# EAGLE schematic attiny85 (EAGLE 9.6.2)
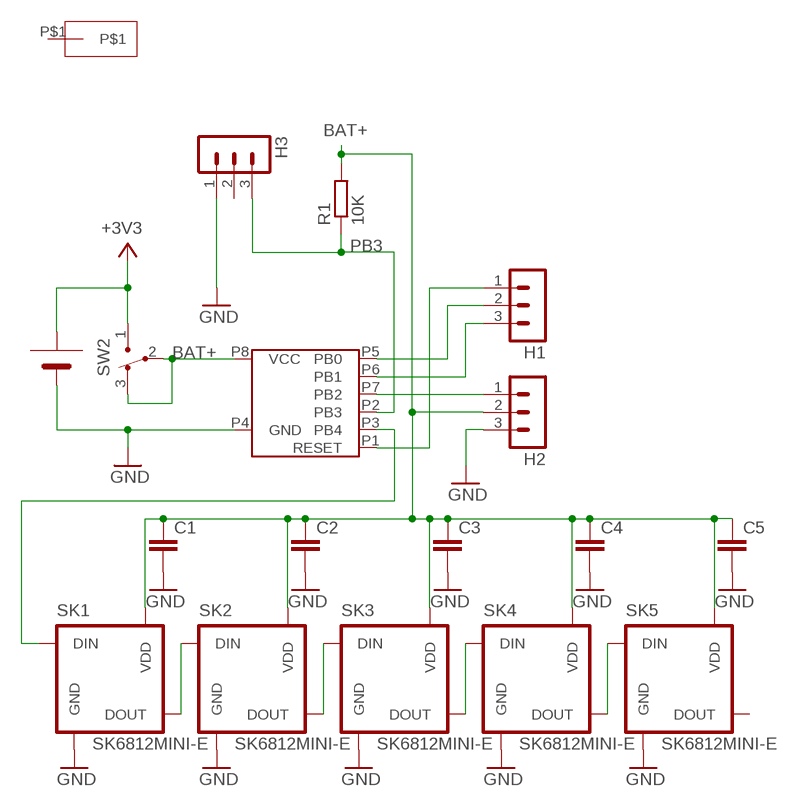
[diagram p0: schematic, sheet 1]

## Parts
ATTINY85-1  ATTINY85  ATTINY85SOP8  [ATTINY85-20SUR]
BAT1  BAT-CR2032B  [BAT-CR2032-2]
C1  C-EUC2012  [C2012]
C2  C-EUC2012  [C2012]
C3  C-EUC2012  [C2012]
C4  C-EUC2012  [C2012]
C5  C-EUC2012  [C2012]
H1  PINHEAD-MA03-1SMD  [PINHEAD-MA03-2]
H2  PINHEAD-MA03-1SMD  [PINHEAD-MA03-2]
H3  PINHEAD-MA03-1  [PINHEAD-MA03-1]
PAD33  PAD_10X3  [PAD-10X3]
R1  10K  R-EU_M3216  [M3216]
SK1  SK6812MINI-E  [SK6812MINI-E]
SK2  SK6812MINI-E  [SK6812MINI-E]
SK3  SK6812MINI-E  [SK6812MINI-E]
SK4  SK6812MINI-E  [SK6812MINI-E]
SK5  SK6812MINI-E  [SK6812MINI-E]
SW2  POWER  SW3-1  [SW3-1]

## Nets
+3V3: BAT1.BAT+ SW2.1
BAT+: ATTINY85-1.P8(VCC) C1.1 C2.1 C3.1 C4.1 C5.1 H2.2 R1.2 SK1.VDD SK2.VDD SK3.VDD SK4.VDD SK5.VDD SW2.2 SW2.3
GND: ATTINY85-1.P4(GND) BAT1.BAT- C1.2 C2.2 C3.2 C4.2 C5.2 H2.3 H3.1 SK1.GND SK2.GND SK3.GND SK4.GND SK5.GND
N$1: ATTINY85-1.P3(PB4) SK1.DIN
N$2: ATTINY85-1.P7(PB2) H2.1
N$3: ATTINY85-1.P6(PB1) H1.3
N$4: ATTINY85-1.P1(RESET) H1.1
N$5: ATTINY85-1.P5(PB0) H1.2
N$6: SK1.DOUT SK2.DIN
N$7: SK2.DOUT SK3.DIN
N$8: SK3.DOUT SK4.DIN
N$9: SK4.DOUT SK5.DIN
PB3: ATTINY85-1.P2(PB3) H3.3 R1.1
Unconnected: H3.2 PAD33.P$1 SK5.DOUT

## Library data of the parts
ATTINY85-1 = ytani1:ATTINY85
BAT1 = ytani1:BAT-CR2032
C1-C5 = rcl:C-EU: CAPACITOR, European symbol; SPICEPREFIX: C
H1 H2 = ytani1:PINHEAD-MA03-1: PIN HEADER
H3 = ytani1:PINHEAD-MA03-1: PIN HEADER; OC_FARNELL: unknown; OC_NEWARK: unknown
PAD33 = ytani1:PAD
R1 = rcl:R-EU_: RESISTOR, European symbol; SPICEPREFIX: R
SK1-SK5 = ytani1:SK6812MINI-E
SW2 = ytani1:SW3-1: Slide Switch 3x1 pin https://www.amazon.co.jp/gp/product/B01LYVYQNO/ SS12D00G3 2ポジションSPDT 1P2T 3ピン; MF: HiLetgo; URL_AMAZON: https://www.amazon.co.jp/gp/product/B01LYVYQNO/